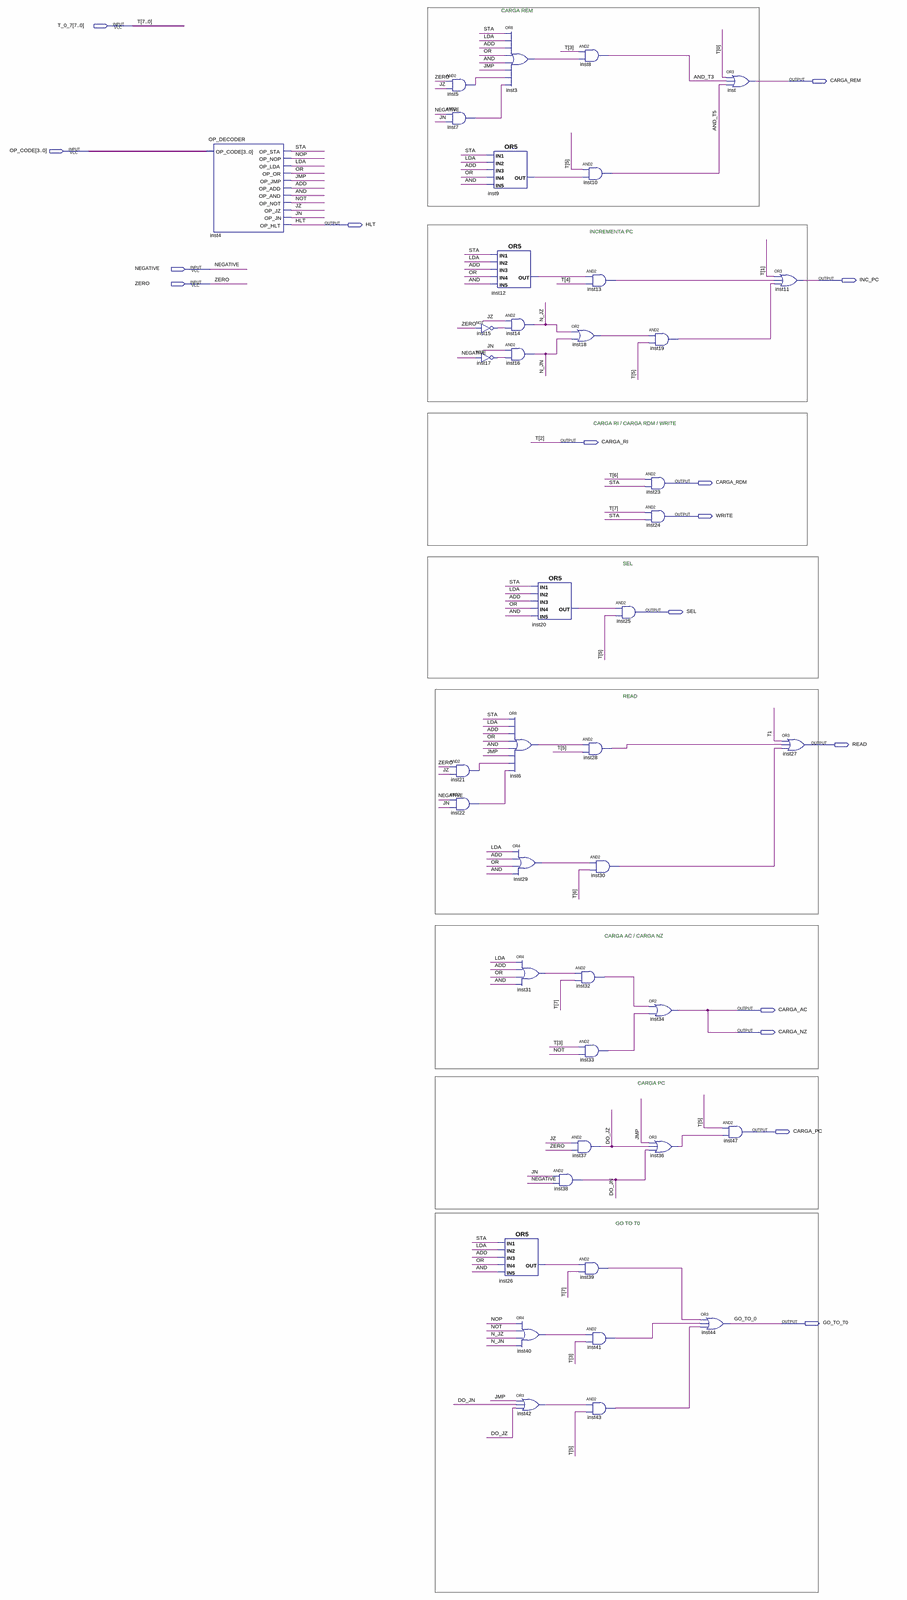
[diagram p0: schematic sheet, whole]
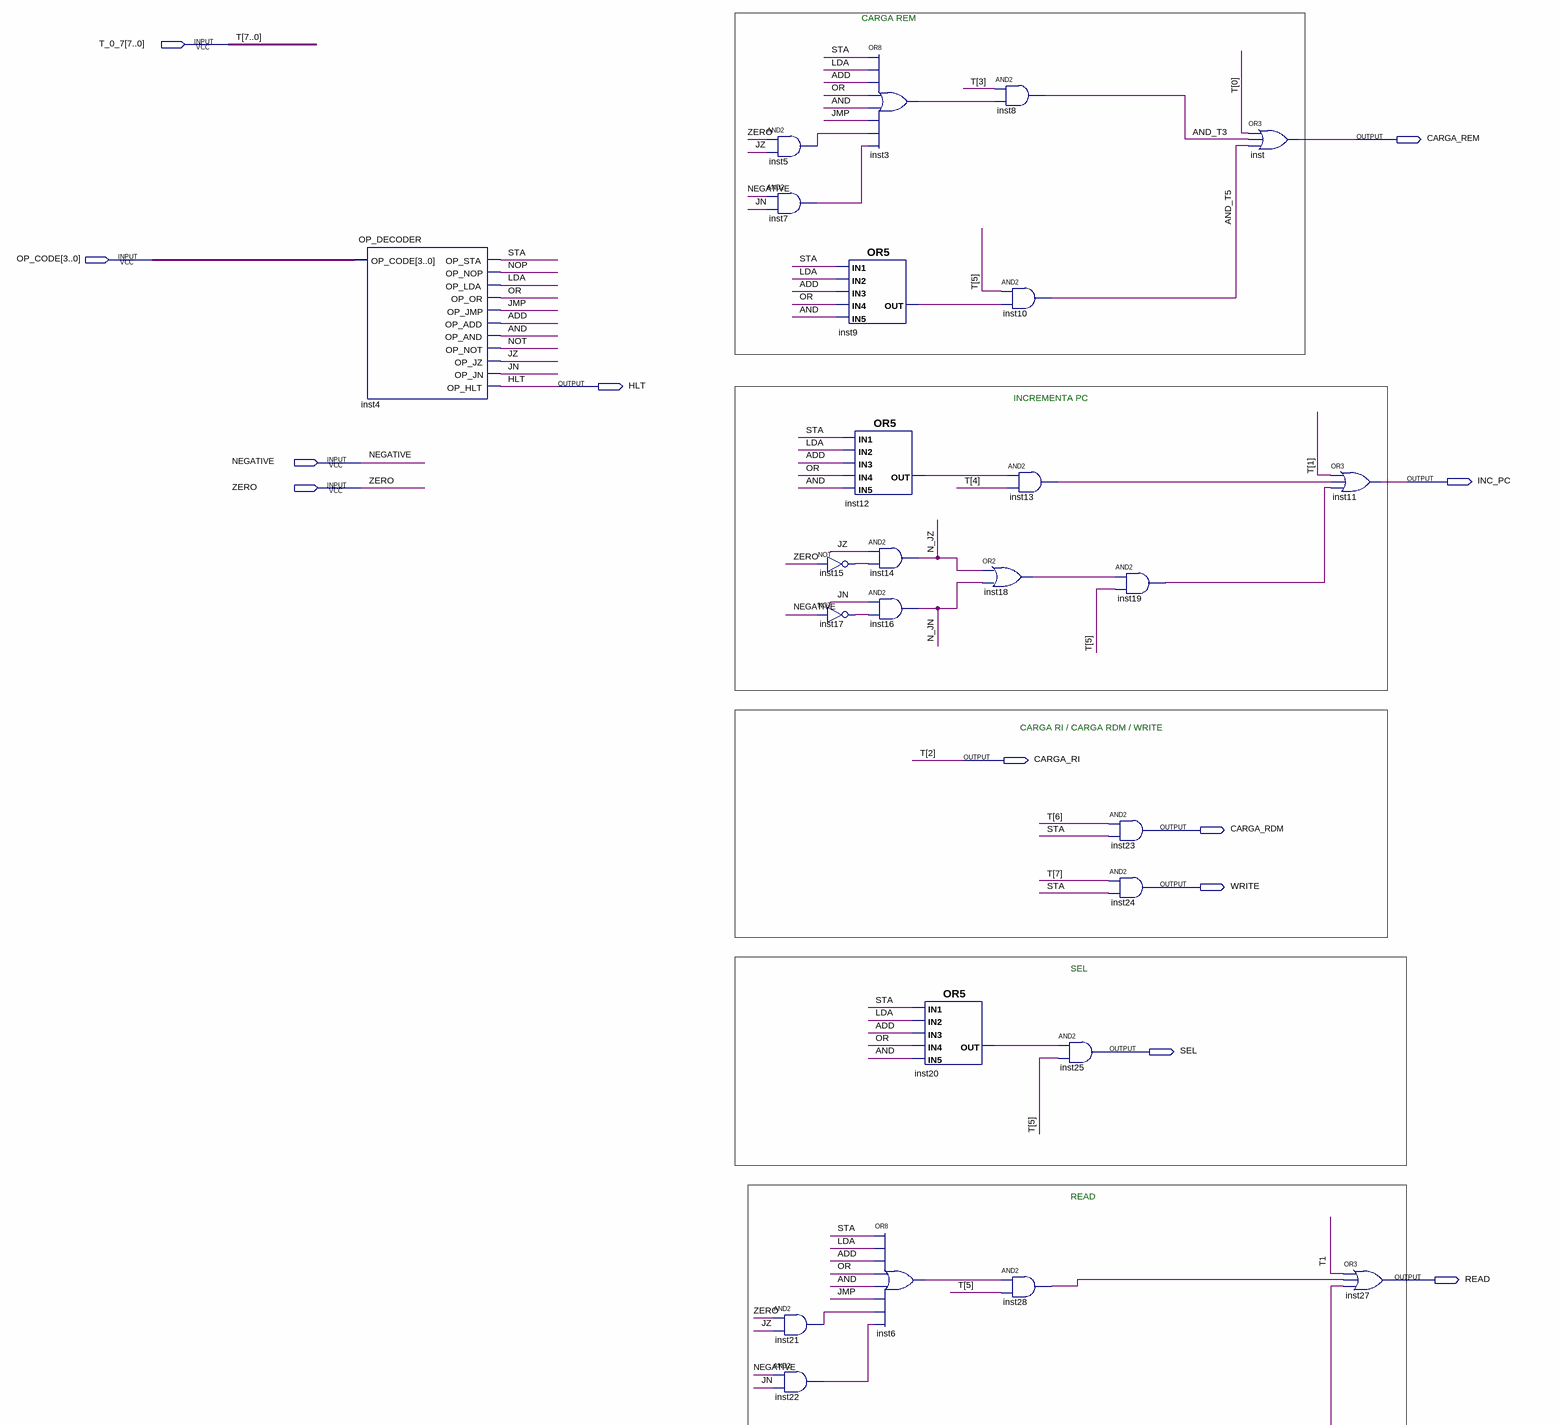
[diagram p1: schematic sheet, upper part]
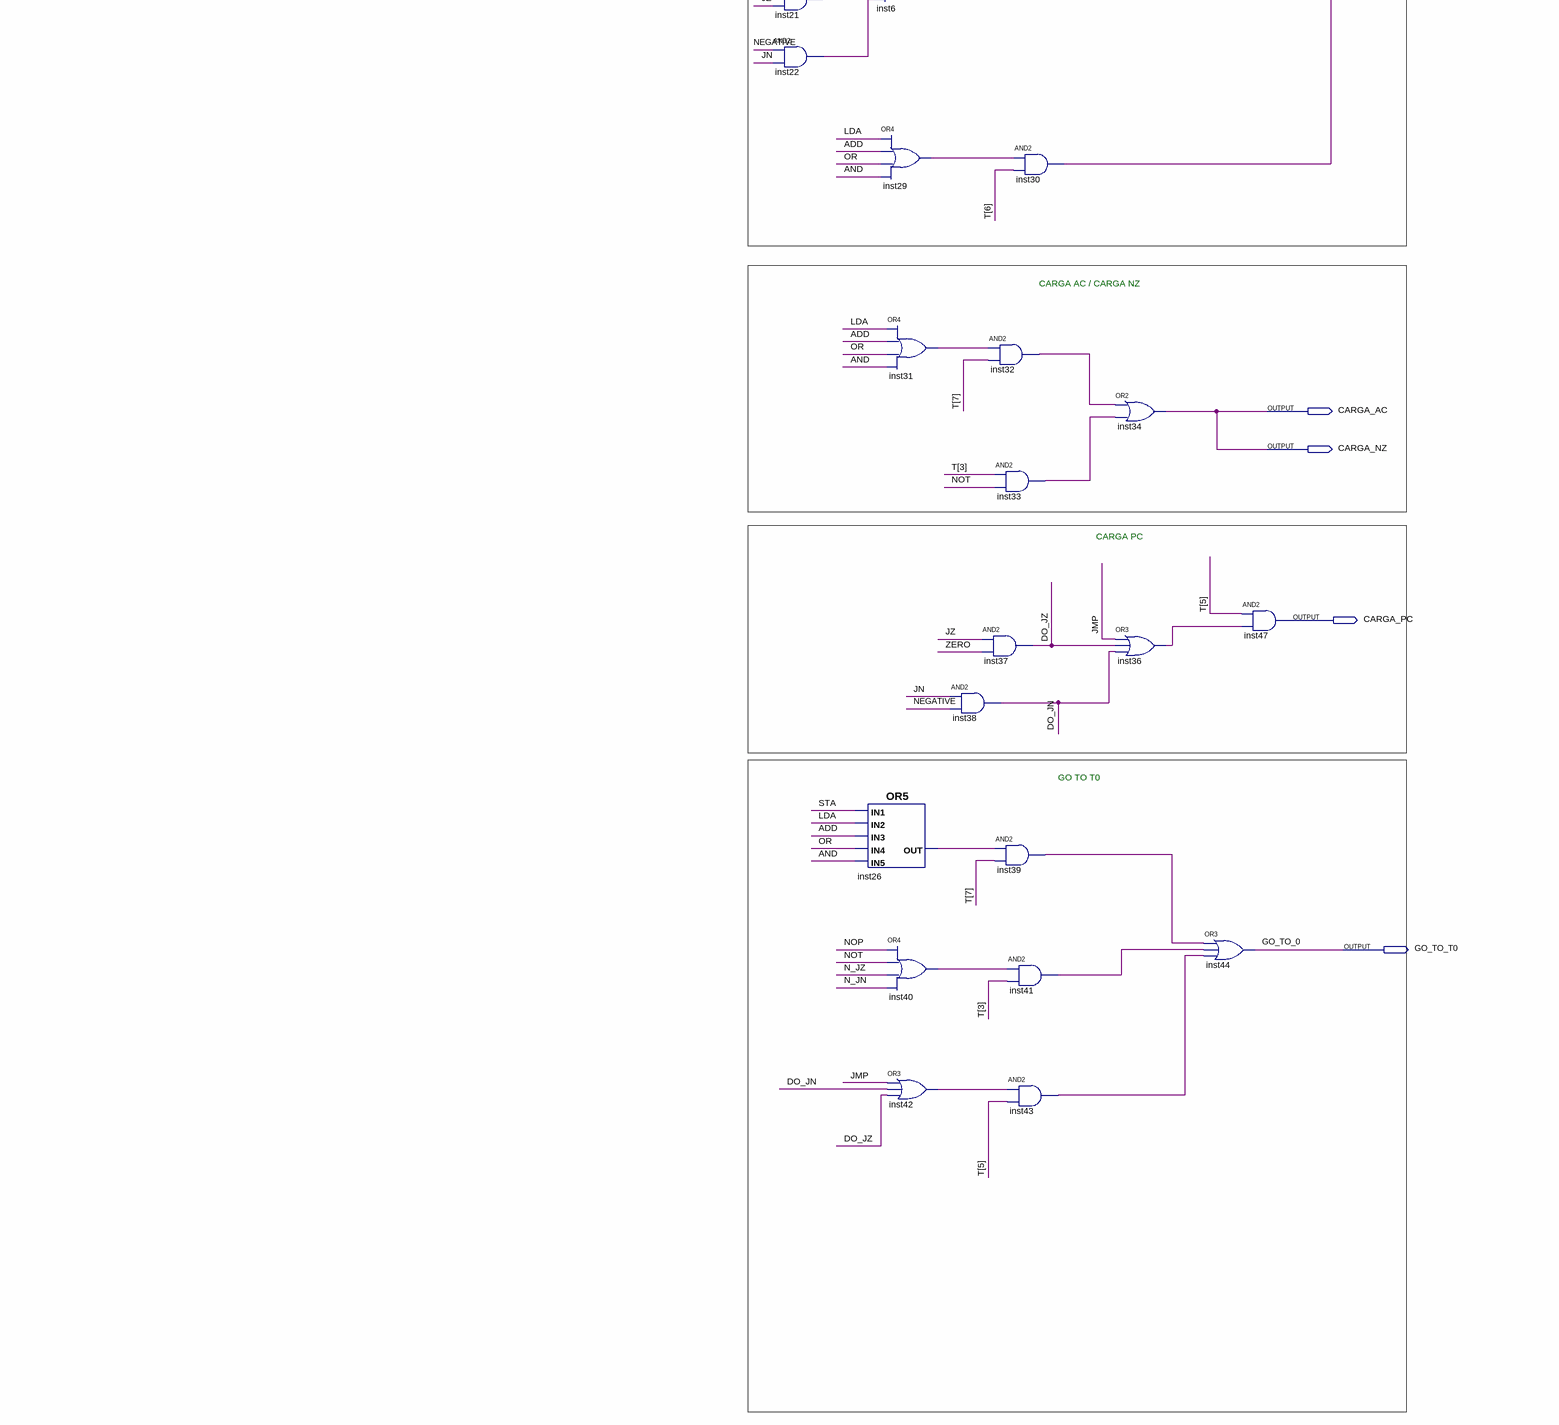
[diagram p2: schematic sheet, lower part]
// Quartus schematic Control_Unit.bdf as structural Verilog: 43 symbols, 16 pins
module Control_Unit (
  input  [7:0] T_0_7,
  input  [3:0] OP_CODE,
  input  NEGATIVE,
  input  ZERO,
  output CARGA_REM,
  output HLT,
  output INC_PC,
  output CARGA_RI,
  output CARGA_RDM,
  output WRITE,
  output SEL,
  output READ,
  output CARGA_AC,
  output CARGA_NZ,
  output CARGA_PC,
  output GO_TO_T0
);

  wire ADD, AND, AND_T3, AND_T5, DO_JN, DO_JZ, inst3_out, inst5_out, inst6_out, inst7_out, inst9_out,
       inst12_out, inst13_out, inst15_out, inst17_out, inst18_out, inst19_out, inst20_out, inst21_out,
       inst22_out, inst26_out, inst28_out, inst29_out, inst30_out, inst31_out, inst32_out, inst33_out,
       inst36_out, inst39_out, inst40_out, inst41_out, inst42_out, inst43_out, JMP, JN, JZ, LDA, N_JN, N_JZ,
       NOP, NOT, OR, STA;

  OP_DECODER inst4 (
    .OP_CODE(OP_CODE), .OP_STA(STA), .OP_NOP(NOP), .OP_LDA(LDA), .OP_OR(OR), .OP_JMP(JMP), .OP_ADD(ADD),
    .OP_AND(AND), .OP_NOT(NOT), .OP_JZ(JZ), .OP_JN(JN), .OP_HLT(HLT));
  and inst5 (inst5_out, ZERO, JZ);
  and inst7 (inst7_out, NEGATIVE, JN);
  and inst21 (inst21_out, ZERO, JZ);
  and inst22 (inst22_out, NEGATIVE, JN);
  or inst9 (inst9_out, STA, LDA, ADD, OR, AND);
  not inst15 (inst15_out, ZERO);
  not inst17 (inst17_out, NEGATIVE);
  or inst3 (inst3_out, STA, LDA, ADD, OR, AND, JMP, inst5_out, inst7_out);
  or inst12 (inst12_out, STA, LDA, ADD, OR, AND);
  and inst14 (N_JZ, JZ, inst15_out);
  and inst16 (N_JN, JN, inst17_out);
  or inst6 (inst6_out, STA, LDA, ADD, OR, AND, JMP, inst21_out, inst22_out);
  or inst29 (inst29_out, LDA, ADD, OR, AND);
  or inst31 (inst31_out, LDA, ADD, OR, AND);
  or inst26 (inst26_out, STA, LDA, ADD, OR, AND);
  or inst40 (inst40_out, NOP, NOT, N_JZ, N_JN);
  or inst42 (inst42_out, JMP, DO_JN, DO_JZ);
  or inst20 (inst20_out, STA, LDA, ADD, OR, AND);
  or inst18 (inst18_out, N_JZ, N_JN);
  and inst32 (inst32_out, inst31_out, T_0_7[7]);
  and inst37 (DO_JZ, JZ, ZERO);
  and inst38 (DO_JN, JN, NEGATIVE);
  and inst8 (AND_T3, T_0_7[3], inst3_out);
  and inst10 (AND_T5, T_0_7[5], inst9_out);
  and inst13 (inst13_out, inst12_out, T_0_7[4]);
  and inst28 (inst28_out, inst6_out, T_0_7[5]);
  and inst30 (inst30_out, inst29_out, T_0_7[6]);
  and inst33 (inst33_out, T_0_7[3], NOT);
  and inst39 (inst39_out, inst26_out, T_0_7[7]);
  and inst41 (inst41_out, inst40_out, T_0_7[3]);
  and inst43 (inst43_out, inst42_out, T_0_7[5]);
  and inst25 (SEL, inst20_out, T_0_7[5]);
  and inst19 (inst19_out, inst18_out, T_0_7[5]);
  and inst23 (CARGA_RDM, T_0_7[6], STA);
  and inst24 (WRITE, T_0_7[7], STA);
  or inst34 (CARGA_AC, inst32_out, inst33_out);
  or inst36 (inst36_out, JMP, DO_JZ, DO_JN);
  and inst47 (CARGA_PC, T_0_7[5], inst36_out);
  or inst44 (GO_TO_T0, inst39_out, inst41_out, inst43_out);
  or inst (CARGA_REM, T_0_7[0], AND_T3, AND_T5);
  or inst11 (INC_PC, T_0_7[1], inst13_out, inst19_out);
  or inst27 (READ, T_0_7[1], inst28_out, inst30_out);

  assign CARGA_NZ = CARGA_AC;
  assign CARGA_RI = T_0_7[2];

  // Other names for the same wires on the sheet: GO_TO_0 = GO_TO_T0; T[7:0] = T_0_7; T1 = T_0_7[1]

  // Notes on the sheet:
  //   CARGA REM
  //   INCREMENTA PC
  //   CARGA RI / CARGA RDM / WRITE 
  //   SEL
  //   READ
  //   CARGA AC / CARGA NZ
  //   CARGA PC
  //   GO TO T0
endmodule
